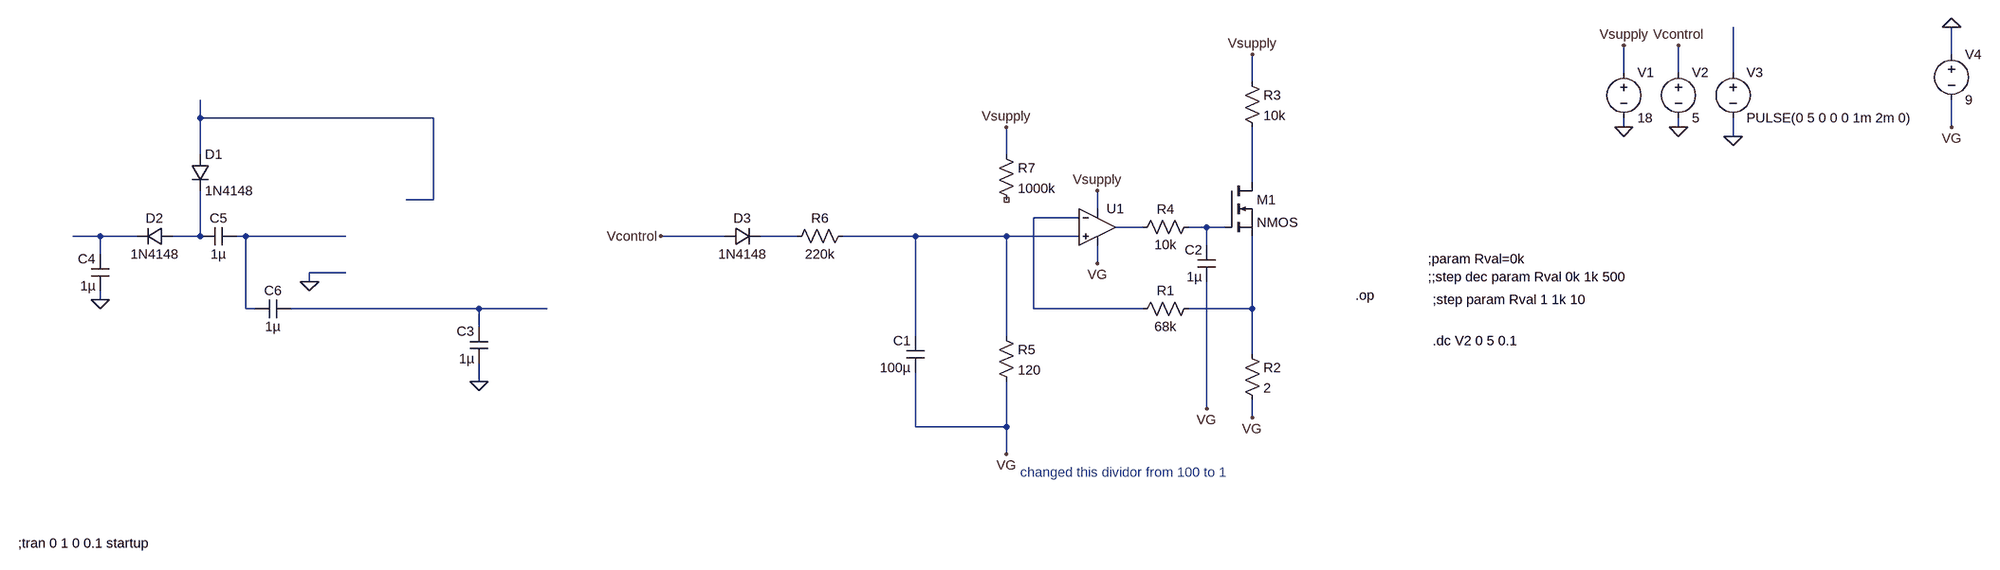
[diagram p0: schematic voltage-controlled-current-virtual-ground.asc]
voltage-controlled-current-virtual-ground.asc, the LTspice schematic file:
Version 4
SHEET 1 1816 792
WIRE 1760 -128 1760 -176
WIRE 1184 -96 1184 -144
WIRE 1280 -96 1280 -144
WIRE 1376 -96 1376 -176
WIRE 384 -80 384 -128
WIRE -2432 -16 -2432 -48
WIRE -1872 -16 -2432 -16
WIRE 1184 0 1184 -16
WIRE 1280 0 1280 -16
WIRE 1760 0 1760 -48
WIRE 1376 16 1376 -16
WIRE -2432 48 -2432 -16
WIRE -48 48 -48 0
WIRE 384 96 384 0
WIRE -1872 128 -1872 -16
WIRE -1872 128 -1920 128
WIRE 112 144 112 112
WIRE 80 160 0 160
WIRE 192 176 144 176
WIRE 304 176 272 176
WIRE 336 176 304 176
WIRE -2608 192 -2656 192
WIRE -2544 192 -2608 192
WIRE -2432 192 -2432 112
WIRE -2432 192 -2480 192
WIRE -2352 192 -2368 192
WIRE -2176 192 -2352 192
WIRE -544 192 -656 192
WIRE -416 192 -480 192
WIRE -208 192 -336 192
WIRE -48 192 -208 192
WIRE 80 192 -48 192
WIRE 304 208 304 176
WIRE -2608 224 -2608 192
WIRE 112 240 112 208
WIRE -2176 256 -2240 256
WIRE -2240 272 -2240 256
WIRE -2608 304 -2608 288
WIRE -2352 320 -2352 192
WIRE -2336 320 -2352 320
WIRE -1792 320 -2272 320
WIRE -1664 320 -1792 320
WIRE 0 320 0 160
WIRE 192 320 0 320
WIRE 384 320 384 192
WIRE 384 320 272 320
WIRE -1792 352 -1792 320
WIRE -208 368 -208 192
WIRE -48 368 -48 192
WIRE 384 400 384 320
WIRE -1792 448 -1792 416
WIRE 304 496 304 272
WIRE 384 512 384 480
WIRE -208 528 -208 432
WIRE -48 528 -48 448
WIRE -48 528 -208 528
WIRE -48 576 -48 528
FLAG 112 240 VG
FLAG 1184 0 0
FLAG 1184 -144 Vsupply
FLAG 112 112 Vsupply
FLAG 1280 0 0
FLAG -656 192 Vcontrol
FLAG -1792 448 0
FLAG -2240 272 0
FLAG -2608 304 0
FLAG 1376 16 0
FLAG 384 -128 Vsupply
FLAG 1280 -144 Vcontrol
FLAG 1760 -176 0
FLAG 1760 0 VG
FLAG 384 512 VG
FLAG 304 496 VG
FLAG -48 576 VG
FLAG -48 0 Vsupply
SYMBOL Opamps\\UniversalOpamp2 112 176 R0
SYMATTR InstName U1
SYMBOL voltage 1184 -112 R0
WINDOW 123 0 0 Left 0
WINDOW 39 0 0 Left 0
SYMATTR InstName V1
SYMATTR Value 18
SYMBOL voltage 1280 -112 R0
WINDOW 123 0 0 Left 0
WINDOW 39 0 0 Left 0
SYMATTR InstName V2
SYMATTR Value 5
SYMBOL res 288 304 R90
WINDOW 0 0 56 VBottom 2
WINDOW 3 32 56 VTop 2
SYMATTR InstName R1
SYMATTR Value 68k
SYMATTR SpiceLine tol=1 pwr=0.1
SYMBOL res 368 384 R0
SYMATTR InstName R2
SYMATTR Value 2
SYMBOL res 368 -96 R0
SYMATTR InstName R3
SYMATTR Value 10k
SYMBOL nmos 336 96 R0
SYMATTR InstName M1
SYMBOL res 288 160 R90
WINDOW 0 0 56 VBottom 2
WINDOW 3 32 56 VTop 2
SYMATTR InstName R4
SYMATTR Value 10k
SYMBOL res -64 352 R0
SYMATTR InstName R5
SYMATTR Value 120
SYMBOL res -320 176 R90
WINDOW 0 0 56 VBottom 2
WINDOW 3 32 56 VTop 2
SYMATTR InstName R6
SYMATTR Value 220k
SYMBOL diode -2448 48 R0
SYMATTR InstName D1
SYMATTR Value 1N4148
SYMBOL diode -2480 176 R90
WINDOW 0 0 32 VBottom 2
WINDOW 3 32 32 VTop 2
SYMATTR InstName D2
SYMATTR Value 1N4148
SYMBOL cap -2368 176 R90
WINDOW 0 0 32 VBottom 2
WINDOW 3 32 32 VTop 2
SYMATTR InstName C5
SYMATTR Value 1µ
SYMBOL cap -2272 304 R90
WINDOW 0 0 32 VBottom 2
WINDOW 3 32 32 VTop 2
SYMATTR InstName C6
SYMATTR Value 1µ
SYMBOL cap -1776 416 R180
WINDOW 0 24 56 Left 2
WINDOW 3 24 8 Left 2
SYMATTR InstName C3
SYMATTR Value 1µ
SYMBOL cap -2592 288 R180
WINDOW 0 24 56 Left 2
WINDOW 3 24 8 Left 2
SYMATTR InstName C4
SYMATTR Value 1µ
SYMBOL voltage 1376 -112 R0
WINDOW 123 0 0 Left 0
WINDOW 39 0 0 Left 0
SYMATTR InstName V3
SYMATTR Value PULSE(0 5 0 0 0 1m 2m 0)
SYMBOL cap -192 432 R180
WINDOW 0 24 56 Left 2
WINDOW 3 24 8 Left 2
SYMATTR InstName C1
SYMATTR Value 100µ
SYMBOL cap 320 272 R180
WINDOW 0 24 56 Left 2
WINDOW 3 24 8 Left 2
SYMATTR InstName C2
SYMATTR Value 1µ
SYMBOL voltage 1760 -144 R0
WINDOW 123 0 0 Left 0
WINDOW 39 0 0 Left 0
SYMATTR InstName V4
SYMATTR Value 9
SYMBOL diode -544 208 R270
WINDOW 0 32 32 VTop 2
WINDOW 3 0 32 VBottom 2
SYMATTR InstName D3
SYMATTR Value 1N4148
SYMBOL res -64 32 R0
SYMATTR InstName R7
SYMATTR Value 1000k
TEXT 848 376 Left 2 !.dc V2 0 5 0.1
TEXT 712 296 Left 2 !.op
TEXT -2752 776 Left 2 !;tran 0 1 0 0.1 startup
TEXT -24 608 Left 2 ;changed this dividor from 100 to 1
TEXT 840 264 Left 2 !;;step dec param Rval 0k 1k 500
TEXT 840 232 Left 2 !;param Rval=0k
TEXT 848 304 Left 2 !;step param Rval 1 1k 10

The netlist it stands for:
* voltage-controlled-current-virtual-ground.asc
XU1 N011 N004 Vsupply VG N005 level.2 Avol=1Meg GBW=10Meg Slew=10Meg ilimit=25m rail=0 Vos=0 phimargin=45 en=0 enk=0 in=0 ink=0 Rin=500Meg  ; pins IN+ IN- V+ V- OUT
V1 Vsupply 0 18
V2 Vcontrol 0 5
R1 N013 N004 68k tol=1 pwr=0.1
R2 N013 VG 2
R3 Vsupply N003 10k
M1 N003 N006 N013 N013 NMOS
R4 N006 N005 10k
R5 N011 VG 120
R6 N011 N010 220k
D1 N002 N008 1N4148
D2 N008 N007 1N4148
C5 N009 N008 1µ
C6 N012 N009 1µ
C3 0 N012 1µ
C4 0 N007 1µ
V3 N001 0 PULSE(0 5 0 0 0 1m 2m 0)
C1 VG N011 100µ
C2 VG N006 1µ
V4 0 VG 9
D3 Vcontrol N010 1N4148
R7 Vsupply NC_01 1000k
.model D D
.lib standard.dio
.model NMOS NMOS
.model PMOS PMOS
.lib standard.mos
.dc V2 0 5 0.1
.op
;tran 0 1 0 0.1 startup
* changed this dividor from 100 to 1
;;step dec param Rval 0k 1k 500
;param Rval=0k
;step param Rval 1 1k 10
.lib UniversalOpamps2.sub
.backanno
.end